# Altium schematic sheet Sheet1.SchDoc
size A; SheetNumber: 1; SheetTotal: 1
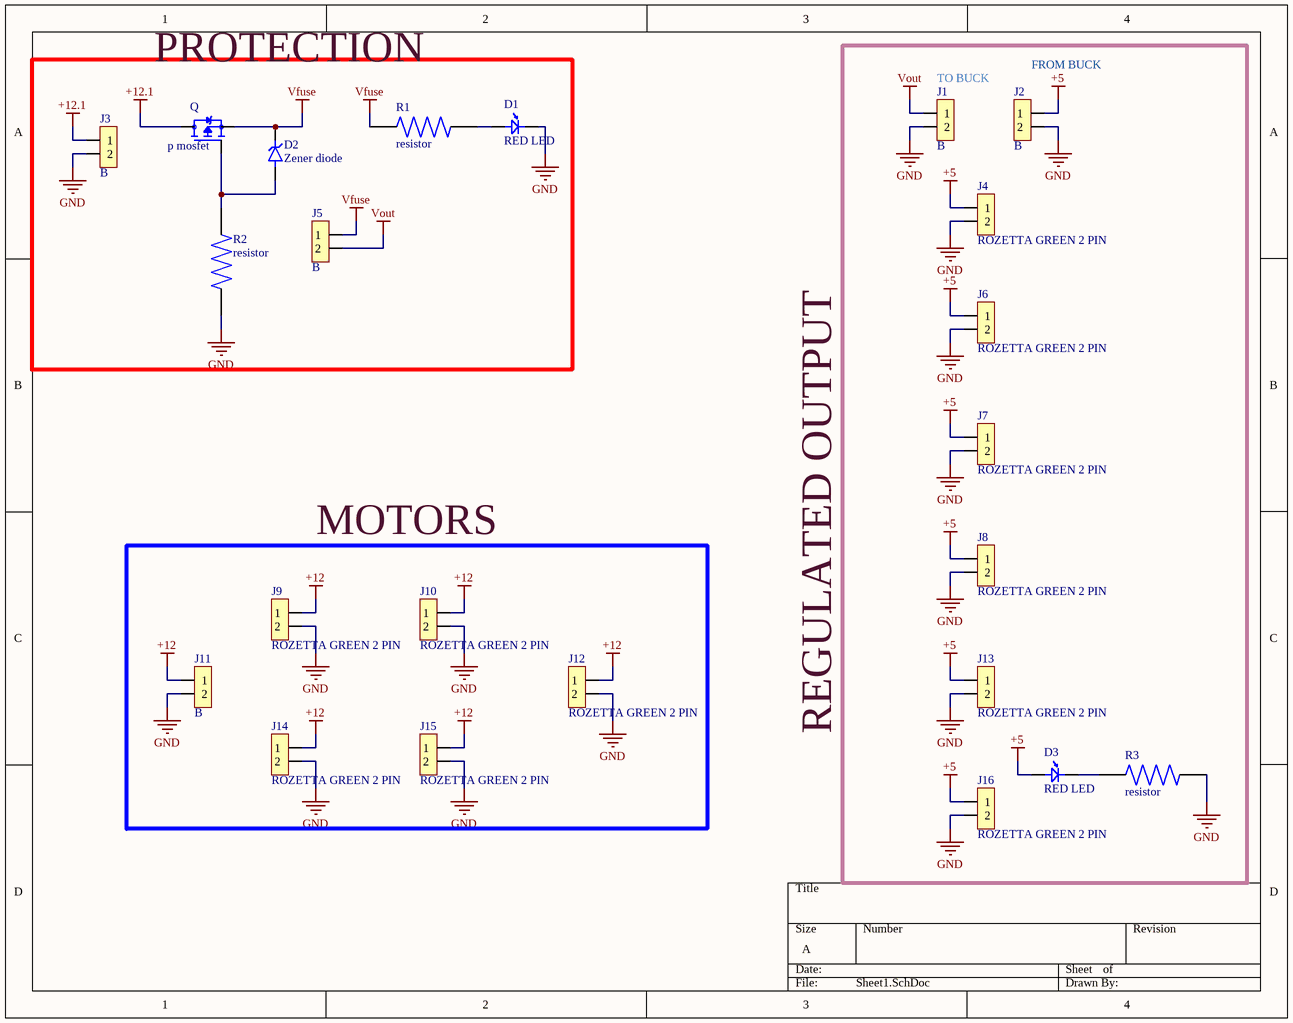
[diagram p0: Sheet1.SchDoc]

## Parts
D1  RED LED  [LED_SSL-LX4673GD-LA20]
D2  Zener diode  [DIOAD928W47L399D179]
D3  RED LED  [LED_SSL-LX4673GD-LA20]
J1  B  [barrier terminal]
J2  B  [barrier terminal]
J3  B  [barrier terminal]
J4  ROZETTA GREEN 2 PIN  [ROZETTA 2 PIN]
J5  B  [barrier terminal]
J6  ROZETTA GREEN 2 PIN  [ROZETTA 2 PIN]
J7  ROZETTA GREEN 2 PIN  [ROZETTA 2 PIN]
J8  ROZETTA GREEN 2 PIN  [ROZETTA 2 PIN]
J9  ROZETTA GREEN 2 PIN  [ROZETTA 2 PIN]
J10  ROZETTA GREEN 2 PIN  [ROZETTA 2 PIN]
J11  B  [barrier terminal]
J12  ROZETTA GREEN 2 PIN  [ROZETTA 2 PIN]
J13  ROZETTA GREEN 2 PIN  [ROZETTA 2 PIN]
J14  ROZETTA GREEN 2 PIN  [ROZETTA 2 PIN]
J15  ROZETTA GREEN 2 PIN  [ROZETTA 2 PIN]
J16  ROZETTA GREEN 2 PIN  [ROZETTA 2 PIN]
Q  p mosfet  [TO254P1054X469X2933-3]
R1  resistor  [RESAD1081W64L635D269]
R2  resistor  [RESAD1081W64L635D269]
R3  resistor  [RESAD1081W64L635D269]

## Blocks framed on the sheet
PROTECTION: D1 D2 J3 J5 Q R1 R2
REGULATED OUTPUT: D3 J1 J2 J4 J6-J8 J13 J16 R3
MOTORS: J9-J12 J14 J15

## Nets
+5: D3.1 J2.1 J4.1 J6.1 J7.1 J8.1 J13.1 J16.1
+12: J9.1 J10.1 J11.1 J12.1 J14.1 J15.1
+12.1: J3.1 Q.2(D)
GND: D1.2 J1.2 J2.2 J3.2 J4.2 J6.2 J7.2 J8.2 J9.2 J10.2 J11.2 J12.2 J13.2 J14.2 J15.2 J16.2 R2.1 R3.2
Vfuse: D2.C(K) J5.1 Q.3(S) R1.1
Vout: J1.1 J5.2
NetD1_1: D1.1 R1.2
NetD2_A: D2.A Q.1(G) R2.2
NetD3_2: D3.2 R3.1

## Notes on the sheet
- (near J1) TO BUCK
- (near J2) FROM BUCK

## Library data of the parts
D2 = Zener diode: MP: BZX55B10; Value: *; Availability: Unavailable; Package: None; Price: None
J1-J3 J5 J11 = barrier terminal: 1x2P Corner pin Barrier Block 2 1 9.5mm -40℃~+105℃ 32A 750V Black 12~22 Straight pin 4 Plugin,P=9.5mm Barrier Terminal Blocks ROHS; manufacturer: DORABO; manufacturer part number: DBT50G-9.5-2P; supplier: LCSC; supplier part number: C395958
Q = p mosfet: P-Channel 100V 38A _Tc_ 3.1W _Ta_, 170W _Tc_ Surface Mount D2PAK; MF: Infineon Technologies; MP: IRF5210; SnapEDA_Link: https://www.snapeda.com/parts/IRF5210/Infineon%20Technologies/view-part/2777330/?ref=snap; Price: None; Value: *; Availability: Unavailable; Package: TO-220 Infineon Technologies
R1-R3 = resistor: Resistor,Metal Film, ERC-55 100K 1% T-2 RNC55H1003FR B14 | Vishay Dale RNC55H1003FRB14; SnapEDA_Link: https://www.snapeda.com/parts/RNC55H1003FRB14/Vishay/view-part/?ref=snap; Package: erc55 Vishay; Value: *; MF: Vishay; MP: RNC55H1003FRB14; Check_prices: https://www.snapeda.com/parts/RNC55H1003FRB14/Vishay/view-part/?ref=eda